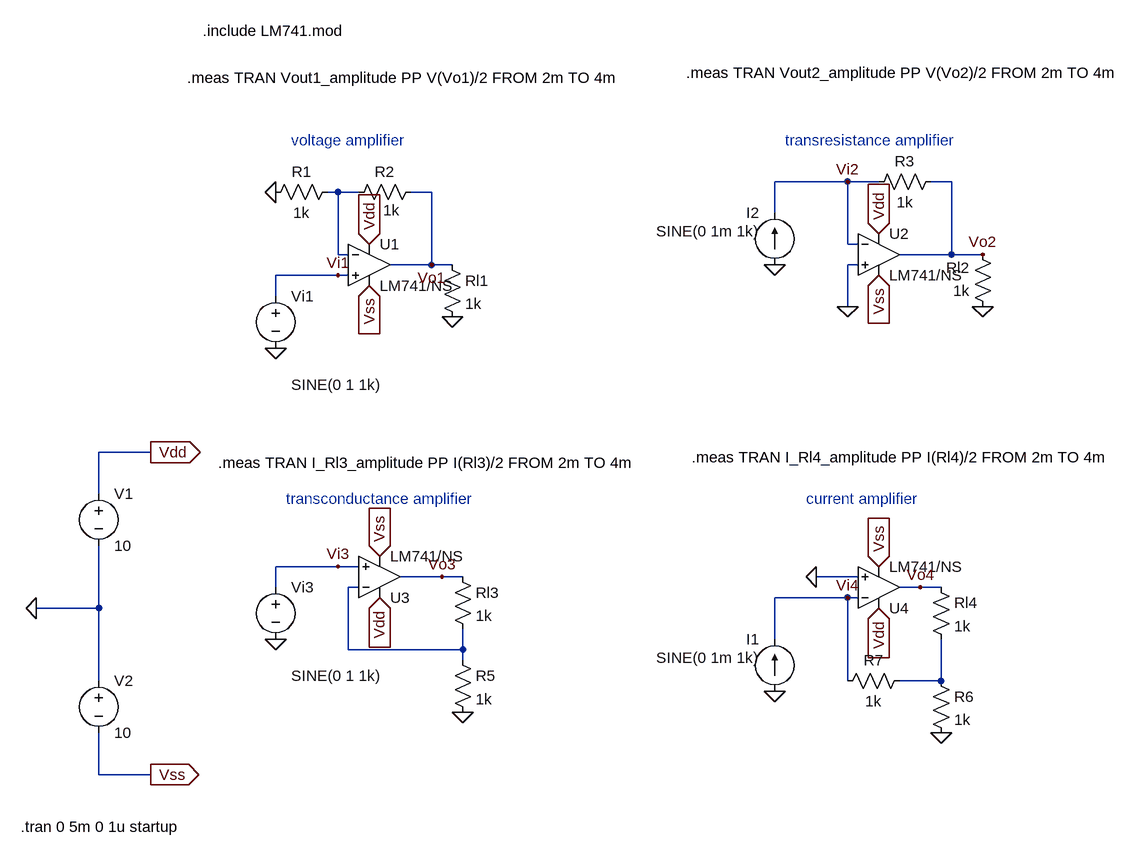
[diagram p0: schematic amplifiers.asc]
amplifiers.asc, the LTspice schematic file:
Version 4
SHEET 1 1220 680
WIRE 768 -384 656 -384
WIRE 816 -384 768 -384
WIRE 928 -384 896 -384
WIRE -16 -368 -32 -368
WIRE 16 -368 -16 -368
WIRE 128 -368 96 -368
WIRE 656 -336 656 -384
WIRE 768 -288 768 -384
WIRE 784 -288 768 -288
WIRE -16 -272 -16 -368
WIRE 0 -272 -16 -272
WIRE 928 -272 928 -384
WIRE 928 -272 848 -272
WIRE 976 -272 928 -272
WIRE 128 -256 128 -368
WIRE 128 -256 64 -256
WIRE 160 -256 128 -256
WIRE 784 -256 768 -256
WIRE -16 -240 -112 -240
WIRE 0 -240 -16 -240
WIRE -112 -208 -112 -240
WIRE 768 -192 768 -256
WIRE -304 32 -384 32
WIRE -384 96 -384 32
WIRE -16 208 -112 208
WIRE 16 208 -16 208
WIRE 144 224 80 224
WIRE 176 224 144 224
WIRE 784 224 720 224
WIRE -112 240 -112 208
WIRE 16 240 0 240
WIRE 880 240 848 240
WIRE 912 240 880 240
WIRE 768 256 656 256
WIRE 784 256 768 256
WIRE -384 272 -384 176
WIRE -384 272 -480 272
WIRE 656 320 656 256
WIRE 0 336 0 240
WIRE 176 336 176 304
WIRE 176 336 0 336
WIRE 176 352 176 336
WIRE -384 384 -384 272
WIRE 768 384 768 256
WIRE 912 384 912 320
WIRE 912 384 848 384
WIRE -384 528 -384 464
WIRE -304 528 -384 528
FLAG -304 32 Vdd
IOPIN -304 32 Out
FLAG -304 528 Vss
IOPIN -304 528 Out
FLAG -480 272 0
FLAG 32 -288 Vdd
IOPIN 32 -288 In
FLAG 816 -304 Vdd
IOPIN 816 -304 In
FLAG 48 256 Vdd
IOPIN 48 256 In
FLAG 816 272 Vdd
IOPIN 816 272 In
FLAG 32 -224 Vss
IOPIN 32 -224 In
FLAG 48 192 Vss
IOPIN 48 192 In
FLAG 816 208 Vss
IOPIN 816 208 In
FLAG 816 -240 Vss
IOPIN 816 -240 In
FLAG -112 -128 0
FLAG 160 -176 0
FLAG -112 -368 0
FLAG 128 -256 Vo1
FLAG -112 320 0
FLAG 176 432 0
FLAG 656 -256 0
FLAG 976 -192 0
FLAG 768 -192 0
FLAG 720 224 0
FLAG 656 400 0
FLAG 912 464 0
FLAG 976 -272 Vo2
FLAG 880 240 Vo4
FLAG 144 224 Vo3
FLAG -16 -240 Vi1
FLAG 768 -384 Vi2
FLAG 768 256 Vi4
FLAG -16 208 Vi3
SYMBOL voltage -384 80 R0
WINDOW 123 0 0 Left 0
WINDOW 39 0 0 Left 0
SYMATTR InstName V1
SYMATTR Value 10
SYMBOL voltage -384 368 R0
WINDOW 123 0 0 Left 0
WINDOW 39 0 0 Left 0
SYMATTR InstName V2
SYMATTR Value 10
SYMBOL voltage -112 -224 R0
WINDOW 123 24 124 Left 2
WINDOW 39 0 0 Left 0
WINDOW 3 24 152 Left 2
SYMATTR InstName Vi1
SYMATTR Value SINE(0 1 1k)
SYMBOL res -16 -384 R90
WINDOW 0 0 56 VBottom 2
WINDOW 3 32 56 VTop 2
SYMATTR InstName R1
SYMATTR Value 1k
SYMBOL res 112 -384 R90
WINDOW 0 0 56 VBottom 2
WINDOW 3 28 46 VTop 2
SYMATTR InstName R2
SYMATTR Value 1k
SYMBOL res 144 -272 R0
SYMATTR InstName Rl1
SYMATTR Value 1k
SYMBOL res 160 208 R0
SYMATTR InstName Rl3
SYMATTR Value 1k
SYMBOL res 160 336 R0
SYMATTR InstName R5
SYMATTR Value 1k
SYMBOL res 912 -400 R90
WINDOW 0 0 56 VBottom 2
WINDOW 3 32 56 VTop 2
SYMATTR InstName R3
SYMATTR Value 1k
SYMBOL res 992 -176 R180
WINDOW 0 36 76 Left 2
WINDOW 3 36 40 Left 2
SYMATTR InstName Rl2
SYMATTR Value 1k
SYMBOL current 656 -256 R180
WINDOW 0 24 80 Left 2
WINDOW 3 24 52 Left 2
WINDOW 123 24 -28 Left 2
WINDOW 39 0 0 Left 0
SYMATTR InstName I2
SYMATTR Value SINE(0 1m 1k)
SYMBOL res 896 224 R0
SYMATTR InstName Rl4
SYMATTR Value 1k
SYMBOL res 896 368 R0
SYMATTR InstName R6
SYMATTR Value 1k
SYMBOL res 864 368 R90
WINDOW 0 0 56 VBottom 2
WINDOW 3 32 56 VTop 2
SYMATTR InstName R7
SYMATTR Value 1k
SYMBOL OpAmps\\opamp2 816 -336 R0
SYMATTR InstName U2
SYMATTR Value LM741/NS
SYMBOL OpAmps\\opamp2 32 -320 R0
SYMATTR InstName U1
SYMATTR Value LM741/NS
SYMBOL OpAmps\\opamp2 48 288 M180
SYMATTR InstName U3
SYMATTR Value LM741/NS
SYMBOL OpAmps\\opamp2 816 304 M180
SYMATTR InstName U4
SYMATTR Value LM741/NS
SYMBOL voltage -112 224 R0
WINDOW 123 24 124 Left 2
WINDOW 39 0 0 Left 0
WINDOW 3 24 152 Left 2
SYMATTR InstName Vi3
SYMATTR Value SINE(0 1 1k)
SYMBOL current 656 400 R180
WINDOW 0 24 80 Left 2
WINDOW 3 24 52 Left 2
WINDOW 123 24 -28 Left 2
WINDOW 39 0 0 Left 0
SYMATTR InstName I1
SYMATTR Value SINE(0 1m 1k)
TEXT -88 -448 Left 2 ;voltage amplifier
TEXT 704 104 Left 2 ;current amplifier
TEXT -96 104 Left 2 ;transconductance amplifier
TEXT 672 -448 Left 2 ;transresistance amplifier
TEXT -504 608 Left 2 !.tran 0 5m 0 1u startup
TEXT -224 -616 Left 2 !.include LM741.mod
TEXT -248 -544 Left 2 !.meas TRAN Vout1_amplitude PP V(Vo1)/2 FROM 2m TO 4m
TEXT 520 -552 Left 2 !.meas TRAN Vout2_amplitude PP V(Vo2)/2 FROM 2m TO 4m
TEXT -200 48 Left 2 !.meas TRAN I_Rl3_amplitude PP I(Rl3)/2 FROM 2m TO 4m
TEXT 528 40 Left 2 !.meas TRAN I_Rl4_amplitude PP I(Rl4)/2 FROM 2m TO 4m

The netlist it stands for:
* amplifiers.asc
V1 Vdd 0 10
V2 0 Vss 10
Vi1 Vi1 0 SINE(0 1 1k)
R1 N001 0 1k
R2 Vo1 N001 1k
Rl1 Vo1 0 1k
Rl3 Vo3 N002 1k
R5 N002 0 1k
R3 Vo2 Vi2 1k
Rl2 0 Vo2 1k
I2 0 Vi2 SINE(0 1m 1k)
Rl4 Vo4 N003 1k
R6 N003 0 1k
R7 N003 Vi4 1k
XU2 0 Vi2 Vdd Vss Vo2 LM741/NS  ; pins In+ In- V+ V- OUT
XU1 Vi1 N001 Vdd Vss Vo1 LM741/NS  ; pins In+ In- V+ V- OUT
XU3 Vi3 N002 Vdd Vss Vo3 LM741/NS  ; pins In+ In- V+ V- OUT
XU4 0 Vi4 Vdd Vss Vo4 LM741/NS  ; pins In+ In- V+ V- OUT
Vi3 Vi3 0 SINE(0 1 1k)
I1 0 Vi4 SINE(0 1m 1k)
* voltage amplifier
* current amplifier
* transconductance amplifier
* transresistance amplifier
.tran 0 5m 0 1u startup
.include LM741.mod
.meas TRAN Vout1_amplitude PP V(Vo1)/2 FROM 2m TO 4m
.meas TRAN Vout2_amplitude PP V(Vo2)/2 FROM 2m TO 4m
.meas TRAN I_Rl3_amplitude PP I(Rl3)/2 FROM 2m TO 4m
.meas TRAN I_Rl4_amplitude PP I(Rl4)/2 FROM 2m TO 4m
.backanno
.end